# Altium project Elkapod_power_supply.PrjPcb (part 4 of 6)

## Sheet Electronics_power_supply_DC_converter.SchDoc: Electronics power supply
size A3; SheetNumber: 2; SheetTotal: 10
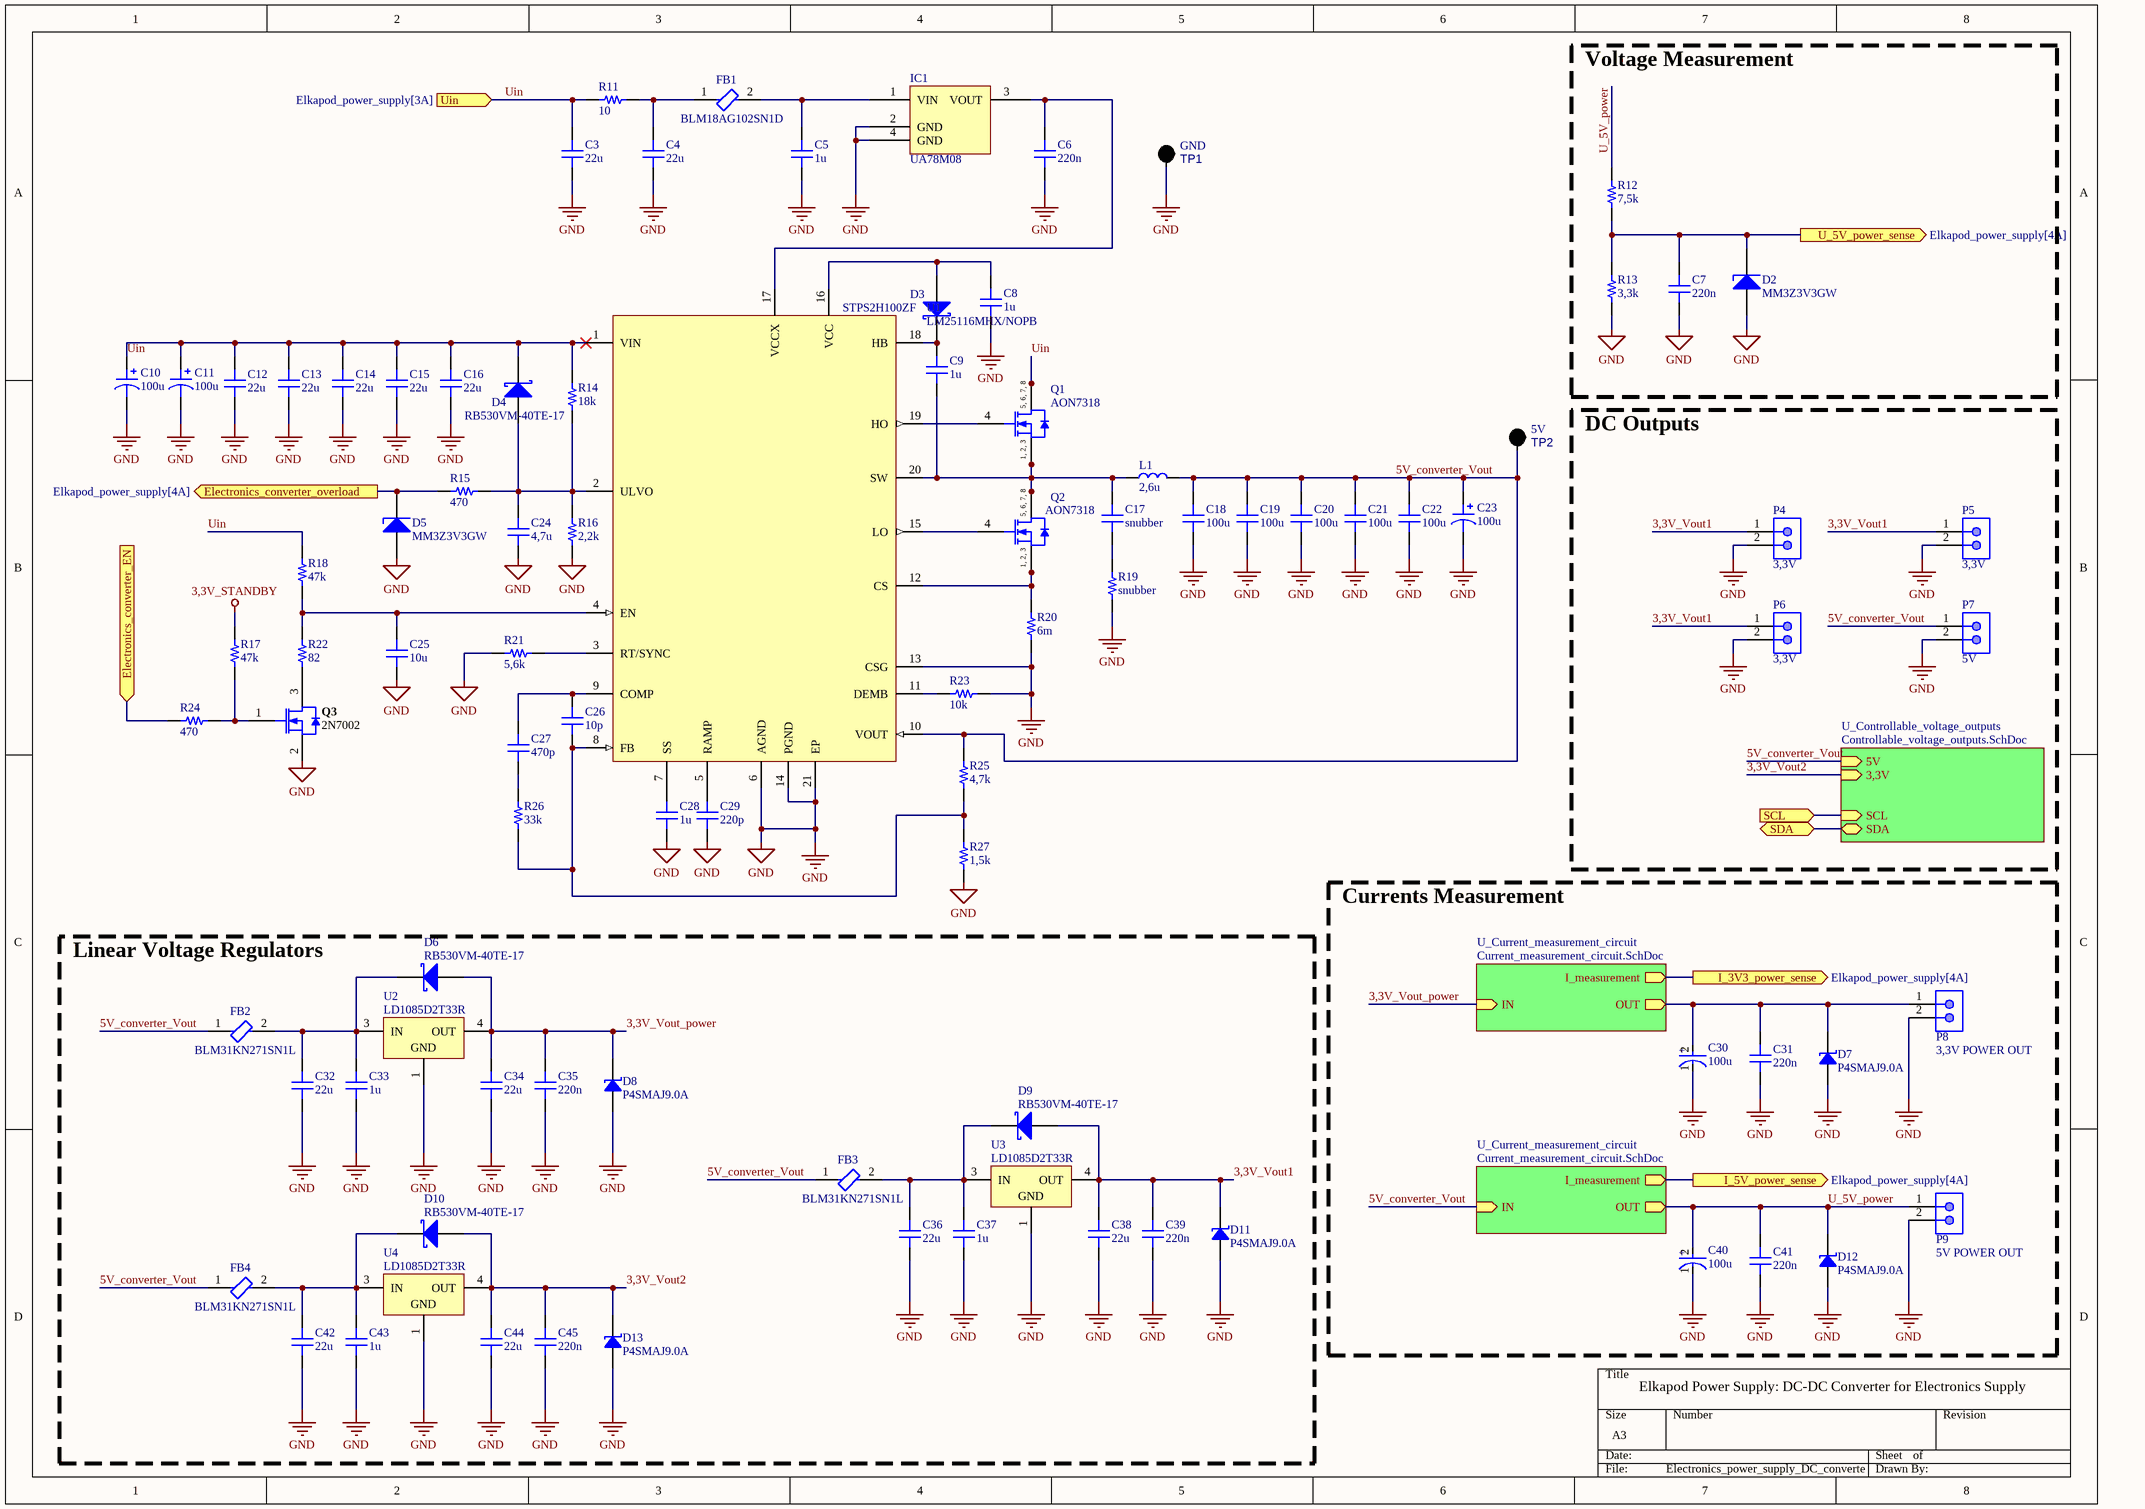
[diagram p7: Electronics_power_supply_DC_converter.SchDoc]

### Parts
C3  22u  [CAP 0805_2012]
C4  22u  [CAP 0805_2012]
C5  1u  [CAP 0603_1608]
C6  220n  [CAP 0603_1608]
C7  220n  [CAP 0603_1608]
C8  1u  [CAP 0603_1608]
C9  1u  [CAP 0603_1608]
C10  100u  [CAP ALSMD 8.3MM H10.5MM]
C11  100u  [CAP ALSMD 8.3MM H10.5MM]
C12  22u  [CAP 0805_2012]
C13  22u  [CAP 0805_2012]
C14  22u  [CAP 0805_2012]
C15  22u  [CAP 0805_2012]
C16  22u  [CAP 0805_2012]
C17  snubber  [CAP 0603_1608]
C18  100u  [CAP 1210_3225 - 1MM]
C19  100u  [CAP 1210_3225 - 1MM]
C20  100u  [CAP 1210_3225 - 1MM]
C21  100u  [CAP 1210_3225 - 1MM]
C22  100u  [CAP 1210_3225 - 1MM]
C23  100u  [CAP ALSMD 8.3MM H10.5MM]
C24  4,7u  [CAP 0603_1608]
C25  10u  [CAP 0603_1608]
C26  10p  [CAP 0603_1608]
C27  470p  [CAP 0603_1608]
C28  1u  [CAP 0603_1608]
C29  220p  [CAP 0603_1608]
C30  100u  [FP-FKE-MFG]
C31  220n  [CAP 0603_1608]
C32  22u  [CAP 0805_2012]
C33  1u  [CAP 0603_1608]
C34  22u  [CAP 0805_2012]
C35  220n  [CAP 0603_1608]
C36  22u  [CAP 0805_2012]
C37  1u  [CAP 0603_1608]
C38  22u  [CAP 0805_2012]
C39  220n  [CAP 0603_1608]
C40  100u  [FP-FKE-MFG]
C41  220n  [CAP 0603_1608]
C42  22u  [CAP 0805_2012]
C43  1u  [CAP 0603_1608]
C44  22u  [CAP 0805_2012]
C45  220n  [CAP 0603_1608]
D2  MM3Z3V3GW  [SOD323]
D3  STPS2H100ZF  [DIOD-SOD-123-2_V]
D4  RB530VM-40TE-17  [SOD-323]
D5  MM3Z3V3GW  [SOD323]
D6  RB530VM-40TE-17  [SOD-323]
D7  P4SMAJ9.0A  [DO214AC SMA]
D8  P4SMAJ9.0A  [DO214AC SMA]
D9  RB530VM-40TE-17  [SOD-323]
D10  RB530VM-40TE-17  [SOD-323]
D11  P4SMAJ9.0A  [DO214AC SMA]
D12  P4SMAJ9.0A  [DO214AC SMA]
D13  P4SMAJ9.0A  [DO214AC SMA]
FB1  BLM18AG102SN1D  [FP-BLM18-0_15-t0_8-MFG]
FB2  BLM31KN271SN1L  [FP-BLM31-0_2-t1_6-d3_3-MFG]
FB3  BLM31KN271SN1L  [FP-BLM31-0_2-t1_6-d3_3-MFG]
FB4  BLM31KN271SN1L  [FP-BLM31-0_2-t1_6-d3_3-MFG]
IC1  UA78M08  [TI SOT-223 DCY]
L1  2,6u  [18,3x18,2_INDUCTOR]
P4  3,3V  [MOLX-22-23-2021_V]
P5  3,3V  [MOLX-22-23-2021_V]
P6  3,3V  [MOLX-22-23-2021_V]
P7  5V  [MOLX-22-23-2021_V]
P8  3,3V POWER OUT  [XT60PW-M]
P9  5V POWER OUT  [XT60PW-M]
Q1  AON7318  [INF-PG-TSDSON-8-1_V]
Q2  AON7318  [INF-PG-TSDSON-8-1_V]
Q3  2N7002  [INF-PG-SOT23_M]
R11  10  [RES 1206_3216]
R12  7,5k  [RES 0603_1608]
R13  3,3k  [RES 0603_1608]
R14  18k  [RES 0603_1608]
R15  470  [RES 0603_1608]
R16  2,2k  [RES 0603_1608]
R17  47k  [RES 0603_1608]
R18  47k  [RES 0603_1608]
R19  snubber  [RES 1206_3216]
R20  6m  [STACKPOLE CSM2512]
R21  5,6k  [RES 0603_1608]
R22  82  [RES 0603_1608]
R23  10k  [RES 0603_1608]
R24  470  [RES 0603_1608]
R25  4,7k  [RES 0603_1608]
R26  33k  [RES 0603_1608]
R27  1,5k  [RES 0603_1608]
TP1  GND  [Keystone_5006_BLACK]
TP2  5V  [Keystone_5006_BLACK]
U1  LM25116MHX/NOPB  [PWP0020A_L]
U2  LD1085D2T33R  [TO-263_M]
U3  LD1085D2T33R  [TO-263_M]
U4  LD1085D2T33R  [TO-263_M]

### Blocks framed on the sheet
Voltage Measurement: C7 D2 R12 R13
DC Outputs: P4-P7
Currents Measurement: C30 C31 C40 C41 D7 D12 P8 P9
Linear Voltage Regulators: C32-C39 C42-C45 D6 D8-D11 D13 FB2-FB4 U2-U4

### Sub-sheets
U_Controllable_voltage_outputs = Controllable_voltage_outputs.SchDoc: 5V (in), 3,3V (in), SCL (in), SDA (bidir)
U_Current_measurement_circuit = Current_measurement_circuit.SchDoc: I_measurement (out), IN (in), OUT (out)  | Rsense_value: 8m
U_Current_measurement_circuit = Current_measurement_circuit.SchDoc: I_measurement (out), IN (in), OUT (out)  | Rsense_value: 8m

### Ports
Electronics_converter_EN (in, see Elkapod_power_supply[3A]), Electronics_converter_overload (out, see Elkapod_power_supply[4A]), I_3V3_power_sense (out, see Elkapod_power_supply[4A]), I_5V_power_sense (out, see Elkapod_power_supply[4A]), SCL (in, see Elkapod_power_supply[3A], Controllable_voltage_outputs[2A], Logic_controller[1D], Servos_controller[1C], Servos_DC_converter[5A]), SDA (bidir, see Elkapod_power_supply[3A], Controllable_voltage_outputs[2B], Logic_controller[1D], Servos_controller[1C], Servos_DC_converter[5A]), U_5V_power_sense (out, see Elkapod_power_supply[4A]), Uin (in, see Elkapod_power_supply[3A])

### Nets
3,3V_STANDBY: R17.1
GND: C3.1 C4.1 C5.1 C6.1 C7.1 C8.2 C10.2 C11.2 C12.1 C13.1 C14.1 C15.1 C16.1 C18.1 C19.1 C20.1 C21.1 C22.1 C23.2 C24.1 C25.1 C28.1 C29.1 C30.1(C) C31.2 C32.1 C33.1 C34.1 C35.1 C36.1 C37.1 C38.1 C39.1 C40.1(C) C41.2 C42.1 C43.1 C44.1 C45.1 D2.1(A) D5.1(A) D7.1 D8.1 D11.1 D12.1 D13.1 IC1.2(GND) IC1.4(GND) P4.2 P5.2 P6.2 P7.2 P8.2(-) P9.2(-) Q3.2(SOURCE) R13.2 R16.1 R19.1 R20.1 R21.2 R23.1 R27.2 TP1.0 U1.6(AGND) U1.13(CSG) U1.14(PGND) U1.21(EP) U2.1(GND) U3.1(GND) U4.1(GND)  [project net AGND]
3,3V_Vout1: C38.2 C39.2 D9.2(A) D11.2 P4.1 P5.1 P6.1 U3.4(OUT)  [project net 3,3V_Vout1_2]
3,3V_Vout2: C44.2 C45.2 D10.2(A) D13.2 U4.4(OUT) ; sheet U_Controllable_voltage_outputs/3,3V
3,3V_Vout_power: C34.2 C35.2 D6.2(A) D8.2 U2.4(OUT) ; sheet U_Current_measurement_circuit/IN
5V_converter_Vout: C18.2 C19.2 C20.2 C21.2 C22.2 C23.1 FB2.1 FB3.1 FB4.1 L1.2 P7.1 R25.1 TP2.0 U1.10(VOUT) ; sheet U_Current_measurement_circuit/IN, sheet U_Controllable_voltage_outputs/5V
CONV5_OC: D5.2(K) R15.2 ; port Electronics_converter_overload
ELE_CONV_EN: R24.1 ; port Electronics_converter_EN
I_3V3_POW_SENSE: port I_3V3_power_sense, sheet U_Current_measurement_circuit/I_measurement
I_5V_POW_SENSE: port I_5V_power_sense, sheet U_Current_measurement_circuit/I_measurement
SCL: port SCL, sheet U_Controllable_voltage_outputs/SCL
SDA: port SDA, sheet U_Controllable_voltage_outputs/SDA
U_5V_POW_SENSE: C7.2 D2.2(K) R12.2 R13.1 ; port U_5V_power_sense
U_5V_power: C40.2(A) C41.1 D12.2 P9.1(+) R12.1 ; sheet U_Current_measurement_circuit/OUT
Uin: C3.2 C10.1 C11.1 C12.2 C13.2 C14.2 C15.2 C16.2 D4.1(K) Q1.5(DRAIN) Q1.6(DRAIN) Q1.7(DRAIN) Q1.8(DRAIN) R11.1 R14.1 R18.1 U1.1(VIN) ; port Uin
NetC4_2: C4.2 FB1.1 R11.2
NetC5_2: C5.2 FB1.2 IC1.1(VIN)
NetC6_2: C6.2 IC1.3(VOUT) U1.17(VCCX)
NetC8_1: C8.1 D3.1(A) U1.16(VCC)
NetC9_1: C9.1 C17.2 L1.1 Q1.1(SOURCE) Q1.2(SOURCE) Q1.3(SOURCE) Q2.5(DRAIN) Q2.6(DRAIN) Q2.7(DRAIN) Q2.8(DRAIN) U1.20(SW)
NetC9_2: C9.2 D3.2(K) U1.18(HB)
NetC17_1: C17.1 R19.2
NetC24_2: C24.2 D4.2(A) R14.2 R15.1 R16.2 U1.2(ULVO)
NetC25_2: C25.2 R18.2 R22.1 U1.4(EN)
NetC26_1: C26.1 C27.1 U1.9(COMP)
NetC26_2: C26.2 R25.2 R26.2 R27.1 U1.8(FB)
NetC27_2: C27.2 R26.1
NetC28_2: C28.2 U1.7(SS)
NetC29_2: C29.2 U1.5(RAMP)
NetC30_2: C30.2(A) C31.1 D7.2 P8.1(+) ; sheet U_Current_measurement_circuit/OUT
NetC32_2: C32.2 C33.2 D6.1(K) FB2.2 U2.3(IN)
NetC36_2: C36.2 C37.2 D9.1(K) FB3.2 U3.3(IN)
NetC42_2: C42.2 C43.2 D10.1(K) FB4.2 U4.3(IN)
NetQ1_4: Q1.4(GATE) U1.19(HO)
NetQ2_1: Q2.1(SOURCE) Q2.2(SOURCE) Q2.3(SOURCE) R20.2 U1.12(CS)
NetQ2_4: Q2.4(GATE) U1.15(LO)
NetQ3_1: Q3.1(GATE) R17.2 R24.2
NetQ3_3: Q3.3(DRAIN) R22.2
NetR21_1: R21.1 U1.3(RT/SYNC)
NetR23_2: R23.2 U1.11(DEMB)

### Notes on the sheet
- Elkapod Power Supply: DC-DC Converter for Electronics Supply
- (in symbol BSZ050N03MS G) 5, 6, 7, 8; 1, 2, 3
- (in symbol CMP-2000-06205-2) +
- (in symbol AON7318) 5, 6, 7, 8; 1, 2, 3

### Library data of the parts
C3 C4 C12-C16 C32 C34 C36 C38 C42 C44 = VJ0805Y684KXQTW1BC: CAP CER 22UF 25V X7R 0805; manufacturer: Vishay Vitramon; Tolerance: ±10%; Voltage - Rated: 10V; Part Number: VJ0805Y684KXQTW1BC; Value: 22u; Applications: General Purpose; Capacitance: 22u; componentlink1description: Datasheet; componentlink1url: https://www.vishay.com/docs/28548/vjw1bcbascomseries.pdf; componentlink2description: DigiKey Link; componentlink2url: https://www.digikey.com/en/products/detail/vishay-vitramon/VJ0805Y684KXQTW1BC/8313569; Device Package: 0805 (2012 Metric); lastupdated: 09.02.2024 20:13:13; Lifecycle Status: Active; Minimum Order: 1; Mounting Type: Surface Mount, MLCC; Operating Temperature: -55°C ~ 125°C; Package / Case: 0805 (2012 Metric); packaging: TapeAndReel; partid: 57262; price: 0.05; series: VJ W1BC; Size / Dimension: 0.079" L x 0.049" W (2.00mm x 1.25mm); Temperature Coefficient: X7R; Thickness (Max): 0.053" (1.35mm)
C5 C8 C9 = C0603C272F3GAC7867: CAP CER 1uF 25V X5R 0603; manufacturer: KEMET; Temperature Coefficient: C0G, NP0; Tolerance: ±1%; Part Number: C0603C272F3GAC7867; Value: 1u; Applications: General Purpose; Capacitance: 1u; componentlink1description: Datasheet; componentlink1url: https://api.kemet.com/component-edge/download/datasheet/C0603C272F3GACTU.pdf; componentlink2description: DigiKey Link; componentlink2url: https://www.digikey.com/en/products/detail/kemet/C0603C272F3GAC7867/2200413; Device Package: 0603 (1608 Metric); Features: Low ESL; lastupdated: 09.02.2024 20:10:30; Lifecycle Status: Active; Minimum Order: 1; Mounting Type: Surface Mount, MLCC; Operating Temperature: -55°C ~ 125°C; Package / Case: 0603 (1608 Metric); packaging: TapeAndReel; partid: 2138; Part Status: Active; price: 0.40; series: SMD Comm C0G; Size / Dimension: 0.063" L x 0.031" W (1.60mm x 0.80mm); Thickness (Max): 0.034" (0.87mm); Voltage - Rated: 25V
C6 C7 C31 C35 C39 C41 C45 = C0603C272F3GAC7867: CAP CER 220nF 25V X5R 0603; manufacturer: KEMET; Temperature Coefficient: C0G, NP0; Tolerance: ±1%; Part Number: C0603C272F3GAC7867; Value: 220n; Applications: General Purpose; Capacitance: 220n; componentlink1description: Datasheet; componentlink1url: https://api.kemet.com/component-edge/download/datasheet/C0603C272F3GACTU.pdf; componentlink2description: DigiKey Link; componentlink2url: https://www.digikey.com/en/products/detail/kemet/C0603C272F3GAC7867/2200413; Device Package: 0603 (1608 Metric); Features: Low ESL; lastupdated: 09.02.2024 20:10:30; Lifecycle Status: Active; Minimum Order: 1; Mounting Type: Surface Mount, MLCC; Operating Temperature: -55°C ~ 125°C; Package / Case: 0603 (1608 Metric); packaging: TapeAndReel; partid: 2138; Part Status: Active; price: 0.40; series: SMD Comm C0G; Size / Dimension: 0.063" L x 0.031" W (1.60mm x 0.80mm); Thickness (Max): 0.034" (0.87mm); Voltage - Rated: 25V
C10 C11 C23 = EEE-TC1C101P: UCD1V101MNL1GS; CAP ALUM 100UF 20% 16V SMD; value: 100u
C17 = C0603C272F3GAC7867: CAP CER 50V X5R 0603; manufacturer: KEMET; Temperature Coefficient: C0G, NP0; Tolerance: ±1%; Voltage - Rated: 25V; Part Number: C0603C272F3GAC7867; Value: snubber; Applications: General Purpose; Capacitance: snubber; componentlink1description: Datasheet; componentlink1url: https://api.kemet.com/component-edge/download/datasheet/C0603C272F3GACTU.pdf; componentlink2description: DigiKey Link; componentlink2url: https://www.digikey.com/en/products/detail/kemet/C0603C272F3GAC7867/2200413; Device Package: 0603 (1608 Metric); Features: Low ESL; lastupdated: 09.02.2024 20:10:30; Lifecycle Status: Active; Minimum Order: 1; Mounting Type: Surface Mount, MLCC; Operating Temperature: -55°C ~ 125°C; Package / Case: 0603 (1608 Metric); packaging: TapeAndReel; partid: 2138; Part Status: Active; price: 0.40; series: SMD Comm C0G; Size / Dimension: 0.063" L x 0.031" W (1.60mm x 0.80mm); Thickness (Max): 0.034" (0.87mm)
C18-C22 = CAN13X104KARAC7800: as C60-C64 on sheet Servos_DC_converter; Part Number: CAN13X104KARAC7800; Value: 100u; Applications: Boardflex Sensitive; Capacitance: 100u; componentlink1description: Datasheet; componentlink1url: //media.digikey.com/pdf/Data%20Sheets/Kemet%20PDFs/CAN13X104KARACTU_Spec.pdf; componentlink2description: DigiKey Link; componentlink2url: https://www.digikey.com/en/products/detail/kemet/CAN13X104KARAC7800/9962480; Device Package: 1210 (3225 Metric); Features: Low ESL, Soft Termination; lastupdated: 04.06.2024 19:21:07; Lifecycle Status: Active; Minimum Order: 1; Mounting Type: Surface Mount, MLCC; Operating Temperature: -55°C ~ 125°C; Package / Case: 1210 (3225 Metric); packaging: TapeAndReel; partid: 23615; Part Status: Active; price: 0.39; series: CAN SMD Indust X7R; Size / Dimension: 0.130" L x 0.102" W (3.30mm x 2.60mm); Temperature Coefficient: X7R; Thickness (Max): 0.110" (2.80mm)
C24 = C0603C272F3GAC7867: CAP CER 4,7uF 25V X5R 0603; manufacturer: KEMET; Temperature Coefficient: C0G, NP0; Tolerance: ±1%; Part Number: C0603C272F3GAC7867; Value: 4,7u; Applications: General Purpose; Capacitance: 4,7u; componentlink1description: Datasheet; componentlink1url: https://api.kemet.com/component-edge/download/datasheet/C0603C272F3GACTU.pdf; componentlink2description: DigiKey Link; componentlink2url: https://www.digikey.com/en/products/detail/kemet/C0603C272F3GAC7867/2200413; Device Package: 0603 (1608 Metric); Features: Low ESL; lastupdated: 09.02.2024 20:10:30; Lifecycle Status: Active; Minimum Order: 1; Mounting Type: Surface Mount, MLCC; Operating Temperature: -55°C ~ 125°C; Package / Case: 0603 (1608 Metric); packaging: TapeAndReel; partid: 2138; Part Status: Active; price: 0.40; series: SMD Comm C0G; Size / Dimension: 0.063" L x 0.031" W (1.60mm x 0.80mm); Thickness (Max): 0.034" (0.87mm); Voltage - Rated: 25V
C25 = C0603C272F3GAC7867: CAP CER 10uF 35V X5R 0603; manufacturer: KEMET; Temperature Coefficient: C0G, NP0; Tolerance: ±1%; Voltage - Rated: 25V; Part Number: C0603C272F3GAC7867; Value: 10u; Applications: General Purpose; Capacitance: 10u; componentlink1description: Datasheet; componentlink1url: https://api.kemet.com/component-edge/download/datasheet/C0603C272F3GACTU.pdf; componentlink2description: DigiKey Link; componentlink2url: https://www.digikey.com/en/products/detail/kemet/C0603C272F3GAC7867/2200413; Device Package: 0603 (1608 Metric); Features: Low ESL; lastupdated: 09.02.2024 20:10:30; Lifecycle Status: Active; Minimum Order: 1; Mounting Type: Surface Mount, MLCC; Operating Temperature: -55°C ~ 125°C; Package / Case: 0603 (1608 Metric); packaging: TapeAndReel; partid: 2138; Part Status: Active; price: 0.40; series: SMD Comm C0G; Size / Dimension: 0.063" L x 0.031" W (1.60mm x 0.80mm); Thickness (Max): 0.034" (0.87mm)
C26 = C0603C272F3GAC7867: CAP CER 10pF 50V G0C 0603; manufacturer: KEMET; Temperature Coefficient: C0G, NP0; Tolerance: ±1%; Voltage - Rated: 25V; Part Number: C0603C272F3GAC7867; Value: 10p; Applications: General Purpose; Capacitance: 10p; componentlink1description: Datasheet; componentlink1url: https://api.kemet.com/component-edge/download/datasheet/C0603C272F3GACTU.pdf; componentlink2description: DigiKey Link; componentlink2url: https://www.digikey.com/en/products/detail/kemet/C0603C272F3GAC7867/2200413; Device Package: 0603 (1608 Metric); Features: Low ESL; lastupdated: 09.02.2024 20:10:30; Lifecycle Status: Active; Minimum Order: 1; Mounting Type: Surface Mount, MLCC; Operating Temperature: -55°C ~ 125°C; Package / Case: 0603 (1608 Metric); packaging: TapeAndReel; partid: 2138; Part Status: Active; price: 0.40; series: SMD Comm C0G; Size / Dimension: 0.063" L x 0.031" W (1.60mm x 0.80mm); Thickness (Max): 0.034" (0.87mm)
C27 = C0603C272F3GAC7867: CAP CER 470pF 50V G0C 0603; manufacturer: KEMET; Temperature Coefficient: C0G, NP0; Tolerance: ±1%; Voltage - Rated: 25V; Part Number: C0603C272F3GAC7867; Value: 470p; Applications: General Purpose; Capacitance: 470p; componentlink1description: Datasheet; componentlink1url: https://api.kemet.com/component-edge/download/datasheet/C0603C272F3GACTU.pdf; componentlink2description: DigiKey Link; componentlink2url: https://www.digikey.com/en/products/detail/kemet/C0603C272F3GAC7867/2200413; Device Package: 0603 (1608 Metric); Features: Low ESL; lastupdated: 09.02.2024 20:10:30; Lifecycle Status: Active; Minimum Order: 1; Mounting Type: Surface Mount, MLCC; Operating Temperature: -55°C ~ 125°C; Package / Case: 0603 (1608 Metric); packaging: TapeAndReel; partid: 2138; Part Status: Active; price: 0.40; series: SMD Comm C0G; Size / Dimension: 0.063" L x 0.031" W (1.60mm x 0.80mm); Thickness (Max): 0.034" (0.87mm)
C28 C33 C37 C43 = C0603C272F3GAC7867: CAP CER 1uF 16V X5R 0603; manufacturer: KEMET; Temperature Coefficient: C0G, NP0; Tolerance: ±1%; Voltage - Rated: 25V; Part Number: C0603C272F3GAC7867; Value: 1u; Applications: General Purpose; Capacitance: 1u; componentlink1description: Datasheet; componentlink1url: https://api.kemet.com/component-edge/download/datasheet/C0603C272F3GACTU.pdf; componentlink2description: DigiKey Link; componentlink2url: https://www.digikey.com/en/products/detail/kemet/C0603C272F3GAC7867/2200413; Device Package: 0603 (1608 Metric); Features: Low ESL; lastupdated: 09.02.2024 20:10:30; Lifecycle Status: Active; Minimum Order: 1; Mounting Type: Surface Mount, MLCC; Operating Temperature: -55°C ~ 125°C; Package / Case: 0603 (1608 Metric); packaging: TapeAndReel; partid: 2138; Part Status: Active; price: 0.40; series: SMD Comm C0G; Size / Dimension: 0.063" L x 0.031" W (1.60mm x 0.80mm); Thickness (Max): 0.034" (0.87mm)
C29 = C0603C272F3GAC7867: CAP CER 220pF 50V G0C 0603; manufacturer: KEMET; Temperature Coefficient: C0G, NP0; Tolerance: ±1%; Voltage - Rated: 25V; Part Number: C0603C272F3GAC7867; Value: 220p; Applications: General Purpose; Capacitance: 220p; componentlink1description: Datasheet; componentlink1url: https://api.kemet.com/component-edge/download/datasheet/C0603C272F3GACTU.pdf; componentlink2description: DigiKey Link; componentlink2url: https://www.digikey.com/en/products/detail/kemet/C0603C272F3GAC7867/2200413; Device Package: 0603 (1608 Metric); Features: Low ESL; lastupdated: 09.02.2024 20:10:30; Lifecycle Status: Active; Minimum Order: 1; Mounting Type: Surface Mount, MLCC; Operating Temperature: -55°C ~ 125°C; Package / Case: 0603 (1608 Metric); packaging: TapeAndReel; partid: 2138; Part Status: Active; price: 0.40; series: SMD Comm C0G; Size / Dimension: 0.063" L x 0.031" W (1.60mm x 0.80mm); Thickness (Max): 0.034" (0.87mm)
C30 C40 = CMP-2000-06205-2: CAP ALUM 100UF 20% 25V SMD; Ripple Current (AC): 300mA; Leakage Current: 3uA; Dielectric Material: Aluminium; Impedance: 260mR; Life (Hours): 2000Hour; Max Operating Temperature: 105°C; Voltage Rating (DC): 25V; Packaging: Tape and Reel; Min Operating Temperature: -55°C; Capacitance: 100uF; Ripple Current: 300mA; Mount: Surface Mount; Lead Free: Lead Free; Construction: Cylindrical; Voltage Rating: 25V; RoHS Compliant: Yes; Case/Package: Radial; Height: 6.2mm; Tolerance: 20%; Diameter: 8mm; Termination: SMD/SMT; Package Quantity: 1; Width: 8.3mm; REACH SVHC: No SVHC; Series: FK; Number of Pins: 2; Voltage: 25V; Radiation Hardening: No; Height - Seated (Max): 0.244inch; Length: 6.2mm; ESR (Equivalent Series Resistance): 260mR
D2 D5 = Zener_Diode_SOD323: 3,3V, 0,3W Zener diode; SOD323
D3 = CMP-0303-00004-1: Schottky diode; 2A; 100V
D4 D6 D9 D10 = BAS140W: Schottky diode; 0,1A; 40V; Published: 21-Mar-2003; LatestRevisionDate: 19-Mar-2004; LatestRevisionNote: Silkscreen size reduced.; DatasheetDocument: Oct-1999; PackageDocument: Sep-2000; PackageReference: SOD-323; Publisher: Altium Limited; ComponentLink1Description: Manufacturer Link; ComponentLink1URL: http://www.infineon.com/; ComponentLink2Description: Datasheet; ComponentLink2URL: http://www.infineon.com/upload/Document/cmc_upload/documents/009/386/bas70_bas170series_1.pdf
D7 D8 D11-D13 = SMA6J18A-TP: TVS DIODE 9VDC DO214AC; Part Number: P4SMAJ9.0A
FB1 = CMP-0686-00457-3: Chip Ferrite Bead, 0603, 1000Ω @ 100MHz, 0.5Ω, 25%, 450mA; Number of Circuits: 1; Max DC Current: 400mA; Shielding: Unshielded; DC Resistance (DCR): 500mR; Material: Steel; DC Resistance-Max: 700mR; Impedance: 1kR; Case Code (Imperial): 0603; Max Current Rating: 400mA; Frequency: 100MHz; Min Operating Temperature: -55°C; Case/Package: 0603; Depth: 0.8mm; Lead Free: Lead Free; Core Material: Ferrite; Current Rating: 400mA; Resistance: 500mR; Case Code (Metric): 1608; DC Current: 400mA; Package Quantity: 1; Packaging: Tape and Reel; Width: 0.8mm; Military Standard: Not; Height: 0.8mm; Series: BLM18A; Max Operating Temperature: 125°C; Tolerance: 25%; Termination: SMD/SMT; Test Frequency: 100MHz; Number of Lines: 1; Number of Pins: 2; REACH SVHC: No SVHC; Length: 1.6mm; Radiation Hardening: No
FB2-FB4 = CMP-06046-002074-1: Chip Ferrite Bead, 1206, 270Ω @ 100MHz, 0.016Ω, 25%, 4.5A; DC Resistance (DCR): 16mR; Number of Lines: 1; Mount: Surface Mount; Case Code (Imperial): 1206; Case/Package: 1206; Packaging: Cut Tape; Min Operating Temperature: -55°C; Max Current Rating: 4.5A; Case Code (Metric): 3216; Max Operating Temperature: 125°C
IC1 = LM340MP-5.0/NOPB: IC REG LINEAR 8V 0,5A SOT223; Manufacturer: Texas Instruments; Current - Output: 1.5A; Number of Regulators: 1; Output Configuration: Positive; Output Type: Fixed; Part Number: UA78M08; ComponentLink1Description: Datasheet; ComponentLink1URL: http://www.ti.com/general/docs/suppproductinfo.tsp?distId=10&gotoUrl=http%3A%2F%2Fwww.ti.com%2Flit%2Fgpn%2Flm340; ComponentLink2Description: DigiKey Link; ComponentLink2URL: //digikey.com/product-detail/en/texas-instruments/LM340MP-5.0-NOPB/LM340MP-5.0-NOPBTR-ND/270717; Lifecycle Status: 0; Operating Temperature: 0°C ~ 125°C; Package / Case: TO-261-4, TO-261AA; Packaging: TapeAndReel; Voltage - Output (Min/Fixed): 8V
L1 = 18,3x18,2_INDUCTOR: Power inductor, 2,6uH, Imax = 25,5A, Isat = 50A
P4-P7 = CMP-1704-00001-3: Male Header, Pitch 2.54 mm, 1 x 2 Position, Height 10.67 mm, Tail Length 3.56 mm, 0 to 75 degC, RoHS, Bulk; Package Quantity: 3000; Height: 10.67 mm; RoHSCompliant: True; ComponentLink2URL: https://datasheet.ciiva.com/19454/232266-19454304.pdf; PartNumber: 22-23-2021; Packaging: Bulk; ComponentLink2Description: Datasheet; Min Operating Temperature: 0 degC; ComponentLink1Description: Manufacturer URL; Length: 5.08 mm; Mounting Technology: Through Hole; Max Operating Temperature: 75 degC; REACH SVHC: Unknown; PackageDescription: Male Header, Pitch 2.54 mm, 1 x 2 Position, Height 10.67 mm, Tail Length 3.56 mm; ComponentLink1URL: http://www.molex.com/; Mount: Through Hole; Radiation Hardening: No; Width: 6.35 mm; Pins: 2
P8 P9 = XT60PW-M: XT60PW-M; 30A/500V angled female DC PCB socket (pin1 -> +, pin2 -> -)
Q1 Q2 = BSZ050N03MS G: N-Channel Power-MOSFET, 30 V VDS, 50 A ID, PG-TSDSON-8-1; Manufacturer: Infineon; ID (max): 50 A; IDpuls (max): 190 A; Polarity: N; PackageReference: PG-TSDSON-8-1; PackageDescription: 8-Pin Plastic (Green) Thin Dual Small Outline Non-Leaded Package, 3.3 x 3.3 mm Body, 0.65 mm Pitch; Mounting Technology: Surface Mount
Q3 = CMP-1149-00026-1: N-Channel OptiMOS Small-Signal-Transistor, 60 V VDS, 0.3 A ID, -55 to 150 degC, PG-SOT23, Reel, Green; Manufacturer: Infineon; RDS (on) (max) (@4.5V): 4,000 mOhm; VDS (max): 60 V; IDpuls (max): 1.2Â A; QG: 0.4Â nC; RDS (on) (max): 3,000 mOhm; RthJA (max): 250 K/W; ID (max): 0.3Â A; VGS(th) (max): 2.5Â V; VGS(th) (min): 1.5Â V; Green: TRUE; Ptot (max): 0.5Â W; PackageDescription: 3-Pin Small Outline Transistor Package, 2.9 x 1.3 mm Body, 0.95 mm Pitch; Halogen-free: TRUE; ComponentLink2Description: Datasheet; ComponentLink1URL: http://www.infineon.com/; Packing: Reel; DatasheetVersion: Rev. 2.4; PartNumber: 2N7002; PackageReference: PG-SOT23; PackageVersion: Apr-08; ComponentLink3URL: http://www.infineon.com/dgdl/SOT23-Package_Overview.pdf?folderId=db3a30431936bc4b0119532290053c66&fileId=db3a30431936bc4b0119533468123c85; ComponentLink1Description: Manufacturer URL; Mounting Technology: Surface Mount; ComponentLink3Description: Package Specification; ComponentLink2URL: http://www.infineon.com/dgdl/2N7002_Rev2.4.pdf?folderId=db3a3043156fd573011622e10b5c1f67&fileId=db3a304319bc939a0119c2a9461e79e6
R11 = KRL1632E-M-R120-F-T5: RES 10 OHM 1% 3/4W 1206; Manufacturer: Susumu; Power (Watts): 0.75W, 3/4W; Temperature Coefficient: ±50ppm/°C; Part Number: KRL1632E-M-R120-F-T5; ComponentLink1Description: Datasheet; ComponentLink1URL: http://www.susumu.co.jp/common/pdf/n_catalog_partition09_en.pdf; ComponentLink2Description: DigiKey Link; ComponentLink2URL: https://www.digikey.com/en/products/detail/susumu/KRL1632E-M-R120-F-T5/3738009; Composition: Metal Foil; Device Package: 1206 (3216 Metric); Features: Automotive AEC-Q200, Current Sense; Height - Seated (Max): 0.028" (0.70mm); LastUpdated: 09.02.2024 20:54:46; Lifecycle Status: Active; Minimum Order: 1; Number of Terminations: 2; Operating Temperature: -55°C ~ 155°C; Package / Case: 1206 (3216 Metric); Packaging: TapeAndReel; PartId: 26840; Part Status: Active; Price: 0.09; Ratings: AEC-Q200; Resistance: 10; Series: KRL; Size / Dimension: 0.126" L x 0.063" W (3.20mm x 1.60mm); Supplier Device Package: 1206; Tolerance: ±1%; Value: 10
R12 = RNCS0603BKE10K0: RES 7,5K OHM 1% 0,1W 0603; Manufacturer: Stackpole Electronics Inc; Power (Watts): 0.063W, 1/16W; Temperature Coefficient: ±25ppm/°C; Tolerance: ±0.1%; Part Number: RNCS0603BKE10K0; Value: 7,5k; Composition: Thin Film; Device Package: 0603 (1608 Metric); Features: Anti-Corrosive, Automotive AEC-Q200, Moisture Resistant; Height - Seated (Max): 0.022" (0.55mm); LastUpdated: 09.02.2024 20:43:37; Lifecycle Status: Active; Minimum Order: 1; Number of Terminations: 2; Operating Temperature: -55°C ~ 155°C; Package / Case: 0603 (1608 Metric); Packaging: TapeAndReel; PartId: 4838; Part Status: Active; Price: 0.06; Ratings: AEC-Q200; Resistance: 7,5k; Series: RNCS; Size / Dimension: 0.061" L x 0.031" W (1.55mm x 0.80mm); Supplier Device Package: 0603
R13 = RNCS0603BKE10K0: RES 3,3K OHM 1% 0,1W 0603; Manufacturer: Stackpole Electronics Inc; Power (Watts): 0.063W, 1/16W; Temperature Coefficient: ±25ppm/°C; Tolerance: ±0.1%; Part Number: RNCS0603BKE10K0; Value: 3,3k; Composition: Thin Film; Device Package: 0603 (1608 Metric); Features: Anti-Corrosive, Automotive AEC-Q200, Moisture Resistant; Height - Seated (Max): 0.022" (0.55mm); LastUpdated: 09.02.2024 20:43:37; Lifecycle Status: Active; Minimum Order: 1; Number of Terminations: 2; Operating Temperature: -55°C ~ 155°C; Package / Case: 0603 (1608 Metric); Packaging: TapeAndReel; PartId: 4838; Part Status: Active; Price: 0.06; Ratings: AEC-Q200; Resistance: 3,3k; Series: RNCS; Size / Dimension: 0.061" L x 0.031" W (1.55mm x 0.80mm); Supplier Device Package: 0603
R14 = RNCS0603BKE10K0: RES 18K OHM 1% 0,1W 0603; Manufacturer: Stackpole Electronics Inc; Power (Watts): 0.063W, 1/16W; Temperature Coefficient: ±25ppm/°C; Tolerance: ±0.1%; Part Number: RNCS0603BKE10K0; Value: 18k; Composition: Thin Film; Device Package: 0603 (1608 Metric); Features: Anti-Corrosive, Automotive AEC-Q200, Moisture Resistant; Height - Seated (Max): 0.022" (0.55mm); LastUpdated: 09.02.2024 20:43:37; Lifecycle Status: Active; Minimum Order: 1; Number of Terminations: 2; Operating Temperature: -55°C ~ 155°C; Package / Case: 0603 (1608 Metric); Packaging: TapeAndReel; PartId: 4838; Part Status: Active; Price: 0.06; Ratings: AEC-Q200; Resistance: 18k; Series: RNCS; Size / Dimension: 0.061" L x 0.031" W (1.55mm x 0.80mm); Supplier Device Package: 0603
R15 R24 = RNCS0603BKE10K0: RES 470 OHM 1% 0,1W 0603; Manufacturer: Stackpole Electronics Inc; Power (Watts): 0.063W, 1/16W; Temperature Coefficient: ±25ppm/°C; Tolerance: ±0.1%; Part Number: RNCS0603BKE10K0; Value: 470; Composition: Thin Film; Device Package: 0603 (1608 Metric); Features: Anti-Corrosive, Automotive AEC-Q200, Moisture Resistant; Height - Seated (Max): 0.022" (0.55mm); LastUpdated: 09.02.2024 20:43:37; Lifecycle Status: Active; Minimum Order: 1; Number of Terminations: 2; Operating Temperature: -55°C ~ 155°C; Package / Case: 0603 (1608 Metric); Packaging: TapeAndReel; PartId: 4838; Part Status: Active; Price: 0.06; Ratings: AEC-Q200; Resistance: 470; Series: RNCS; Size / Dimension: 0.061" L x 0.031" W (1.55mm x 0.80mm); Supplier Device Package: 0603
R16 = RNCS0603BKE10K0: RES 2,2K OHM 1% 0,1W 0603; Manufacturer: Stackpole Electronics Inc; Power (Watts): 0.063W, 1/16W; Temperature Coefficient: ±25ppm/°C; Tolerance: ±0.1%; Part Number: RNCS0603BKE10K0; Value: 2,2k; Composition: Thin Film; Device Package: 0603 (1608 Metric); Features: Anti-Corrosive, Automotive AEC-Q200, Moisture Resistant; Height - Seated (Max): 0.022" (0.55mm); LastUpdated: 09.02.2024 20:43:37; Lifecycle Status: Active; Minimum Order: 1; Number of Terminations: 2; Operating Temperature: -55°C ~ 155°C; Package / Case: 0603 (1608 Metric); Packaging: TapeAndReel; PartId: 4838; Part Status: Active; Price: 0.06; Ratings: AEC-Q200; Resistance: 2,2k; Series: RNCS; Size / Dimension: 0.061" L x 0.031" W (1.55mm x 0.80mm); Supplier Device Package: 0603
R17 R18 = RNCS0603BKE10K0: RES 47K OHM 1% 0,1W 0603; Manufacturer: Stackpole Electronics Inc; Power (Watts): 0.063W, 1/16W; Temperature Coefficient: ±25ppm/°C; Tolerance: ±0.1%; Part Number: RNCS0603BKE10K0; Value: 47k; Composition: Thin Film; Device Package: 0603 (1608 Metric); Features: Anti-Corrosive, Automotive AEC-Q200, Moisture Resistant; Height - Seated (Max): 0.022" (0.55mm); LastUpdated: 09.02.2024 20:43:37; Lifecycle Status: Active; Minimum Order: 1; Number of Terminations: 2; Operating Temperature: -55°C ~ 155°C; Package / Case: 0603 (1608 Metric); Packaging: TapeAndReel; PartId: 4838; Part Status: Active; Price: 0.06; Ratings: AEC-Q200; Resistance: 47k; Series: RNCS; Size / Dimension: 0.061" L x 0.031" W (1.55mm x 0.80mm); Supplier Device Package: 0603
R19 = RT1206BRD0775KL: Manufacturer: Yageo; Power (Watts): 0.25W, 1/4W; Temperature Coefficient: ±25ppm/°C; Tolerance: ±0.1%; Part Number: RT1206BRD0775KL; Composition: Thin Film; Device Package: 1206 (3216 Metric); Height - Seated (Max): 0.026" (0.65mm); LastUpdated: 09.02.2024 20:54:46; Lifecycle Status: Active; Minimum Order: 1; Number of Terminations: 2; Operating Temperature: -55°C ~ 155°C; Package / Case: 1206 (3216 Metric); Packaging: TapeAndReel; PartId: 26866; Part Status: Active; Price: 0.09; Series: RT; Size / Dimension: 0.122" L x 0.063" W (3.10mm x 1.60mm); Supplier Device Package: 1206
R20 = CSM2512FT20L0: RES 0,006 OHM 1% 3W 2512; manufacturer: Stackpole Electronics Inc; Temperature Coefficient: ±50ppm/°C; value: 20 mOhms; Part Number: CSM2512FT20L0; componentlink1description: Datasheet; componentlink1url: https://www.seielect.com/Catalog/SEI-CSM.PDF; componentlink2description: DigiKey Link; componentlink2url: https://www.digikey.com/en/products/detail/stackpole-electronics-inc/CSM2512FT20L0/6270239; Composition: Metal Element; Device Package: 2512 (6332 Metric); Features: Current Sense; Height - Seated (Max): 0.035" (0.90mm); lastupdated: 03.06.2024 20:27:03; Lifecycle Status: Active; Minimum Order: 4000; Number of Terminations: 2; Operating Temperature: -55°C ~ 170°C; Package / Case: 2512 (6332 Metric); packaging: TapeAndReel; Part Status: Active; Power (Watts): 3W; price: 0.19; Resistance: 6m; series: CSM; Size / Dimension: 0.252" L x 0.126" W (6.40mm x 3.20mm); Supplier Device Package: 2512; Tolerance: ±1%
R21 = RNCS0603BKE10K0: RES 5,6K OHM 1% 0,1W 0603; Manufacturer: Stackpole Electronics Inc; Power (Watts): 0.063W, 1/16W; Temperature Coefficient: ±25ppm/°C; Tolerance: ±0.1%; Part Number: RNCS0603BKE10K0; Value: 5,6k; Composition: Thin Film; Device Package: 0603 (1608 Metric); Features: Anti-Corrosive, Automotive AEC-Q200, Moisture Resistant; Height - Seated (Max): 0.022" (0.55mm); LastUpdated: 09.02.2024 20:43:37; Lifecycle Status: Active; Minimum Order: 1; Number of Terminations: 2; Operating Temperature: -55°C ~ 155°C; Package / Case: 0603 (1608 Metric); Packaging: TapeAndReel; PartId: 4838; Part Status: Active; Price: 0.06; Ratings: AEC-Q200; Resistance: 5,6k; Series: RNCS; Size / Dimension: 0.061" L x 0.031" W (1.55mm x 0.80mm); Supplier Device Package: 0603
R22 = RNCS0603BKE10K0: RES 82 OHM 1% 0,1W 0603; Manufacturer: Stackpole Electronics Inc; Power (Watts): 0.063W, 1/16W; Temperature Coefficient: ±25ppm/°C; Tolerance: ±0.1%; Part Number: RNCS0603BKE10K0; Value: 82; Composition: Thin Film; Device Package: 0603 (1608 Metric); Features: Anti-Corrosive, Automotive AEC-Q200, Moisture Resistant; Height - Seated (Max): 0.022" (0.55mm); LastUpdated: 09.02.2024 20:43:37; Lifecycle Status: Active; Minimum Order: 1; Number of Terminations: 2; Operating Temperature: -55°C ~ 155°C; Package / Case: 0603 (1608 Metric); Packaging: TapeAndReel; PartId: 4838; Part Status: Active; Price: 0.06; Ratings: AEC-Q200; Resistance: 82; Series: RNCS; Size / Dimension: 0.061" L x 0.031" W (1.55mm x 0.80mm); Supplier Device Package: 0603
R23 = RNCS0603BKE10K0: RES 10K OHM 1% 0,1W 0603; Manufacturer: Stackpole Electronics Inc; Power (Watts): 0.063W, 1/16W; Temperature Coefficient: ±25ppm/°C; Tolerance: ±0.1%; Part Number: RNCS0603BKE10K0; Value: 10k; Composition: Thin Film; Device Package: 0603 (1608 Metric); Features: Anti-Corrosive, Automotive AEC-Q200, Moisture Resistant; Height - Seated (Max): 0.022" (0.55mm); LastUpdated: 09.02.2024 20:43:37; Lifecycle Status: Active; Minimum Order: 1; Number of Terminations: 2; Operating Temperature: -55°C ~ 155°C; Package / Case: 0603 (1608 Metric); Packaging: TapeAndReel; PartId: 4838; Part Status: Active; Price: 0.06; Ratings: AEC-Q200; Resistance: 10k; Series: RNCS; Size / Dimension: 0.061" L x 0.031" W (1.55mm x 0.80mm); Supplier Device Package: 0603
R25 = RNCS0603BKE10K0: RES 4,7K OHM 1% 0,1W 0603; Manufacturer: Stackpole Electronics Inc; Power (Watts): 0.063W, 1/16W; Temperature Coefficient: ±25ppm/°C; Tolerance: ±0.1%; Part Number: RNCS0603BKE10K0; Value: 4,7k; Composition: Thin Film; Device Package: 0603 (1608 Metric); Features: Anti-Corrosive, Automotive AEC-Q200, Moisture Resistant; Height - Seated (Max): 0.022" (0.55mm); LastUpdated: 09.02.2024 20:43:37; Lifecycle Status: Active; Minimum Order: 1; Number of Terminations: 2; Operating Temperature: -55°C ~ 155°C; Package / Case: 0603 (1608 Metric); Packaging: TapeAndReel; PartId: 4838; Part Status: Active; Price: 0.06; Ratings: AEC-Q200; Resistance: 4,7k; Series: RNCS; Size / Dimension: 0.061" L x 0.031" W (1.55mm x 0.80mm); Supplier Device Package: 0603
R26 = RNCS0603BKE10K0: RES 33K OHM 1% 0,1W 0603; Manufacturer: Stackpole Electronics Inc; Power (Watts): 0.063W, 1/16W; Temperature Coefficient: ±25ppm/°C; Tolerance: ±0.1%; Part Number: RNCS0603BKE10K0; Value: 33k; Composition: Thin Film; Device Package: 0603 (1608 Metric); Features: Anti-Corrosive, Automotive AEC-Q200, Moisture Resistant; Height - Seated (Max): 0.022" (0.55mm); LastUpdated: 09.02.2024 20:43:37; Lifecycle Status: Active; Minimum Order: 1; Number of Terminations: 2; Operating Temperature: -55°C ~ 155°C; Package / Case: 0603 (1608 Metric); Packaging: TapeAndReel; PartId: 4838; Part Status: Active; Price: 0.06; Ratings: AEC-Q200; Resistance: 33k; Series: RNCS; Size / Dimension: 0.061" L x 0.031" W (1.55mm x 0.80mm); Supplier Device Package: 0603
R27 = RNCS0603BKE10K0: RES 1,5K OHM 1% 0,1W 0603; Manufacturer: Stackpole Electronics Inc; Power (Watts): 0.063W, 1/16W; Temperature Coefficient: ±25ppm/°C; Tolerance: ±0.1%; Part Number: RNCS0603BKE10K0; Value: 1,5k; Composition: Thin Film; Device Package: 0603 (1608 Metric); Features: Anti-Corrosive, Automotive AEC-Q200, Moisture Resistant; Height - Seated (Max): 0.022" (0.55mm); LastUpdated: 09.02.2024 20:43:37; Lifecycle Status: Active; Minimum Order: 1; Number of Terminations: 2; Operating Temperature: -55°C ~ 155°C; Package / Case: 0603 (1608 Metric); Packaging: TapeAndReel; PartId: 4838; Part Status: Active; Price: 0.06; Ratings: AEC-Q200; Resistance: 1,5k; Series: RNCS; Size / Dimension: 0.061" L x 0.031" W (1.55mm x 0.80mm); Supplier Device Package: 0603
TP1 TP2 = Keystone 5006 Test Point: Keystone 5006 Test Point (BLACK)
U1 = LM25116MHX/NOPB: Wide Range Synchronous Buck Controller, 20-pin TSSOP-EP, Pb-Free; Manufacturer: Texas Instruments; CompType: Switcher; PowerWise: Y; PackageTopMarking: NSUZXYTT*LM25116*MH; PackageDescription: Molded TSSOP, Jedec, 6.5 x 4.4 x 0.9mm Body, 20 Lead, 0.65mm Pitch, Exposed Pad; PinCount: 20; Code_JEDEC: MO-153-ACT; ComponentLink1URL: http://www.ti.com/general/docs/lit/getliterature.tsp?genericPartNumber=LM25116&fileType=pdf; RoHS: Y; ComponentLink1Description: Datasheet URL; PackageReference: PWP0020A
U2-U4 = CMP-0244-00169-1: 3A, Low Drop Positive Voltage Regulator, 3.3V, 3-Pin D2PAK; ComponentLink1URL: http://www.st.com; PackageVersion: 2011; ComponentLink1Description: Manufacturer URL; ComponentLink2URL: http://www.st.com/internet/com/TECHNICAL_RESOURCES/TECHNICAL_LITERATURE/DATASHEET/CD00001883.pdf; PackageDescription: 3-Pin Transistor Outline Package 2.54 mm Pitch, 15.4 mm Lead Span (D2PAK); DatasheetVersion: 28/07/2009; ComponentLink2Description: Datasheet; PackageReference: TO-263

## Sheet Controllable_voltage_outputs.SchDoc
size A4; SheetNumber: 3; SheetTotal: 10
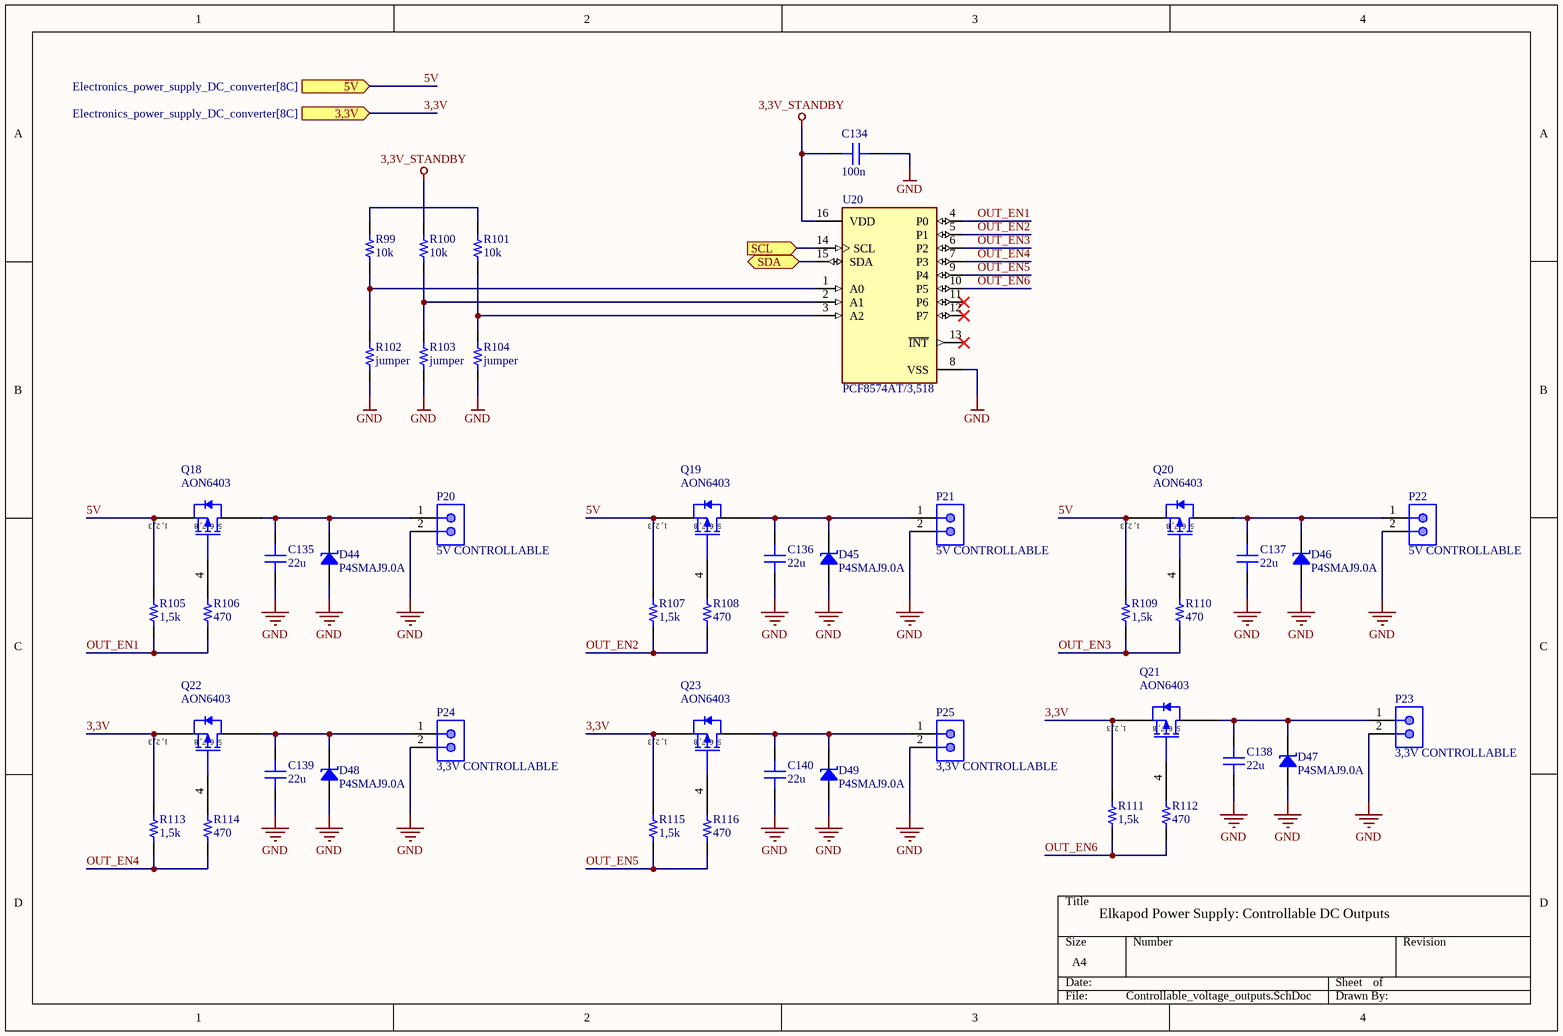
[diagram p8: Controllable_voltage_outputs.SchDoc]

### Parts
C134  100n  [CAP 0603_1608]
C135  22u  [CAP 0805_2012]
C136  22u  [CAP 0805_2012]
C137  22u  [CAP 0805_2012]
C138  22u  [CAP 0805_2012]
C139  22u  [CAP 0805_2012]
C140  22u  [CAP 0805_2012]
D44  P4SMAJ9.0A  [DO214AC SMA]
D45  P4SMAJ9.0A  [DO214AC SMA]
D46  P4SMAJ9.0A  [DO214AC SMA]
D47  P4SMAJ9.0A  [DO214AC SMA]
D48  P4SMAJ9.0A  [DO214AC SMA]
D49  P4SMAJ9.0A  [DO214AC SMA]
P20  5V CONTROLLABLE  [MOLX-22-23-2021_V]
P21  5V CONTROLLABLE  [MOLX-22-23-2021_V]
P22  5V CONTROLLABLE  [MOLX-22-23-2021_V]
P23  3,3V CONTROLLABLE  [MOLX-22-23-2021_V]
P24  3,3V CONTROLLABLE  [MOLX-22-23-2021_V]
P25  3,3V CONTROLLABLE  [MOLX-22-23-2021_V]
Q18  AON6403  [DFN5x6]
Q19  AON6403  [DFN5x6]
Q20  AON6403  [DFN5x6]
Q21  AON6403  [DFN5x6]
Q22  AON6403  [DFN5x6]
Q23  AON6403  [DFN5x6]
R99  10k  [RES 0603_1608]
R100  10k  [RES 0603_1608]
R101  10k  [RES 0603_1608]
R102  value jumper  [RES 0603_1608]  (hidden comment: A0_jumper)
R103  value jumper  [RES 0603_1608]  (hidden comment: A1_jumper)
R104  value jumper  [RES 0603_1608]  (hidden comment: A2_jumper)
R105  1,5k  [RES 0603_1608]
R106  470  [RES 0603_1608]
R107  1,5k  [RES 0603_1608]
R108  470  [RES 0603_1608]
R109  1,5k  [RES 0603_1608]
R110  470  [RES 0603_1608]
R111  1,5k  [RES 0603_1608]
R112  470  [RES 0603_1608]
R113  1,5k  [RES 0603_1608]
R114  470  [RES 0603_1608]
R115  1,5k  [RES 0603_1608]
R116  470  [RES 0603_1608]
U20  PCF8574AT/3,518  [FP-SOT162-1-MFG]

### Ports
3,3V (in, see Electronics_power_supply_DC_converter[8C]), 5V (in, see Electronics_power_supply_DC_converter[8C]), SCL (in, see Electronics_power_supply_DC_converter[8C], Electronics_power_supply_DC_converter[7C], Logic_controller[1D], Servos_controller[1C], Servos_DC_converter[5A]), SDA (bidir, see Electronics_power_supply_DC_converter[8C], Electronics_power_supply_DC_converter[7C], Logic_controller[1D], Servos_controller[1C], Servos_DC_converter[5A])

### Nets
3,3V_STANDBY: C134.2 R100.1 U20.16(VDD)
GND: C134.1 C135.1 C136.1 C137.1 C138.1 C139.1 C140.1 D44.1 D45.1 D46.1 D47.1 D48.1 D49.1 P20.2 P21.2 P22.2 P23.2 P24.2 P25.2 R102.2 R103.2 R104.2 U20.8(VSS)  [project net AGND]
3,3V: Q21.1(S) Q21.2(S) Q21.3(S) Q22.1(S) Q22.2(S) Q22.3(S) Q23.1(S) Q23.2(S) Q23.3(S) R111.1 R113.1 R115.1 ; port 3,3V  [project net 3,3V_Vout2]
5V: Q18.1(S) Q18.2(S) Q18.3(S) Q19.1(S) Q19.2(S) Q19.3(S) Q20.1(S) Q20.2(S) Q20.3(S) R105.1 R107.1 R109.1 ; port 5V  [project net 5V_converter_Vout]
OUT_EN1: R105.2 R106.2 U20.4(P0)  [project net OUT_EN1_3]
OUT_EN2: R107.2 R108.2 U20.5(P1)  [project net OUT_EN2_3]
OUT_EN3: R109.2 R110.2 U20.6(P2)  [project net OUT_EN3_3]
OUT_EN4: R113.2 R114.2 U20.7(P3)  [project net OUT_EN4_3]
OUT_EN5: R115.2 R116.2 U20.9(P4)  [project net OUT_EN5_3]
OUT_EN6: R111.2 R112.2 U20.10(P5)  [project net OUT_EN6_3]
SCL: U20.14(SCL) ; port SCL
SDA: U20.15(SDA) ; port SDA
NetC135_2: C135.2 D44.2 P20.1 Q18.5-6-7-8(D)
NetC136_2: C136.2 D45.2 P21.1 Q19.5-6-7-8(D)
NetC137_2: C137.2 D46.2 P22.1 Q20.5-6-7-8(D)
NetC138_2: C138.2 D47.2 P23.1 Q21.5-6-7-8(D)
NetC139_2: C139.2 D48.2 P24.1 Q22.5-6-7-8(D)
NetC140_2: C140.2 D49.2 P25.1 Q23.5-6-7-8(D)
NetQ18_4: Q18.4(G) R106.1
NetQ19_4: Q19.4(G) R108.1
NetQ20_4: Q20.4(G) R110.1
NetQ21_4: Q21.4(G) R112.1
NetQ22_4: Q22.4(G) R114.1
NetQ23_4: Q23.4(G) R116.1
NetR99_1: R99.1 R101.1
NetR99_2: R99.2 R102.1 U20.1(A0)
NetR100_2: R100.2 R103.1 U20.2(A1)
NetR101_2: R101.2 R104.1 U20.3(A2)

Not connected (* = marked no-connect by the designer): U20 11(P6)* 12(P7)* 13(~{INT})*

### Notes on the sheet
- Elkapod Power Supply: Controllable DC Outputs
- (in symbol AON6403) 1, 2, 3; 5, 6, 7, 8

### Library data of the parts
C134 = C0603C272F3GAC7867: CAP CER 100nF 25V X5R 0603; manufacturer: KEMET; Temperature Coefficient: C0G, NP0; Tolerance: ±1%; Part Number: C0603C272F3GAC7867; Value: 100n; Applications: General Purpose; Capacitance: 100n; componentlink1description: Datasheet; componentlink1url: https://api.kemet.com/component-edge/download/datasheet/C0603C272F3GACTU.pdf; componentlink2description: DigiKey Link; componentlink2url: https://www.digikey.com/en/products/detail/kemet/C0603C272F3GAC7867/2200413; Device Package: 0603 (1608 Metric); Features: Low ESL; lastupdated: 09.02.2024 20:10:30; Lifecycle Status: Active; Minimum Order: 1; Mounting Type: Surface Mount, MLCC; Operating Temperature: -55°C ~ 125°C; Package / Case: 0603 (1608 Metric); packaging: TapeAndReel; partid: 2138; Part Status: Active; price: 0.40; series: SMD Comm C0G; Size / Dimension: 0.063" L x 0.031" W (1.60mm x 0.80mm); Thickness (Max): 0.034" (0.87mm); Voltage - Rated: 25V
C135-C140 = VJ0805Y684KXQTW1BC: as C3 on sheet Electronics_power_supply_DC_converter; Part Number: VJ0805Y684KXQTW1BC; Value: 22u; Applications: General Purpose; Capacitance: 22u; componentlink1description: Datasheet; componentlink1url: https://www.vishay.com/docs/28548/vjw1bcbascomseries.pdf; componentlink2description: DigiKey Link; componentlink2url: https://www.digikey.com/en/products/detail/vishay-vitramon/VJ0805Y684KXQTW1BC/8313569; Device Package: 0805 (2012 Metric); lastupdated: 09.02.2024 20:13:13; Lifecycle Status: Active; Minimum Order: 1; Mounting Type: Surface Mount, MLCC; Operating Temperature: -55°C ~ 125°C; Package / Case: 0805 (2012 Metric); packaging: TapeAndReel; partid: 57262; price: 0.05; series: VJ W1BC; Size / Dimension: 0.079" L x 0.049" W (2.00mm x 1.25mm); Temperature Coefficient: X7R; Thickness (Max): 0.053" (1.35mm)
D44-D49 = SMA6J18A-TP: TVS DIODE 9VDC DO214AC; Part Number: P4SMAJ9.0A
P20-P25 = CMP-1704-00001-3: as P4 on sheet Electronics_power_supply_DC_converter; Package Quantity: 3000; Height: 10.67 mm; RoHSCompliant: True; ComponentLink2URL: https://datasheet.ciiva.com/19454/232266-19454304.pdf; PartNumber: 22-23-2021; Packaging: Bulk; ComponentLink2Description: Datasheet; Min Operating Temperature: 0 degC; ComponentLink1Description: Manufacturer URL; Length: 5.08 mm; Mounting Technology: Through Hole; Max Operating Temperature: 75 degC; REACH SVHC: Unknown; PackageDescription: Male Header, Pitch 2.54 mm, 1 x 2 Position, Height 10.67 mm, Tail Length 3.56 mm; ComponentLink1URL: http://www.molex.com/; Mount: Through Hole; Radiation Hardening: No; Width: 6.35 mm; Pins: 2
Q18-Q23 = AON6403: P-MOSFET; 67A; 30V; DFN5x6
R99-R101 = RNCS0603BKE10K0: as R23 on sheet Electronics_power_supply_DC_converter; Part Number: RNCS0603BKE10K0; Value: 10k; Composition: Thin Film; Device Package: 0603 (1608 Metric); Features: Anti-Corrosive, Automotive AEC-Q200, Moisture Resistant; Height - Seated (Max): 0.022" (0.55mm); LastUpdated: 09.02.2024 20:43:37; Lifecycle Status: Active; Minimum Order: 1; Number of Terminations: 2; Operating Temperature: -55°C ~ 155°C; Package / Case: 0603 (1608 Metric); Packaging: TapeAndReel; PartId: 4838; Part Status: Active; Price: 0.06; Ratings: AEC-Q200; Resistance: 10k; Series: RNCS; Size / Dimension: 0.061" L x 0.031" W (1.55mm x 0.80mm); Supplier Device Package: 0603
R102-R104 = RNCS0603BKE10K0: RES 0 OHM 1% 0,1W 0603; Manufacturer: Stackpole Electronics Inc; Power (Watts): 0.063W, 1/16W; Resistance: 0; Temperature Coefficient: ±25ppm/°C; Tolerance: ±0.1%; Part Number: RNCS0603BKE10K0; Composition: Thin Film; Device Package: 0603 (1608 Metric); Features: Anti-Corrosive, Automotive AEC-Q200, Moisture Resistant; Height - Seated (Max): 0.022" (0.55mm); LastUpdated: 09.02.2024 20:43:37; Lifecycle Status: Active; Minimum Order: 1; Number of Terminations: 2; Operating Temperature: -55°C ~ 155°C; Package / Case: 0603 (1608 Metric); Packaging: TapeAndReel; PartId: 4838; Part Status: Active; Price: 0.06; Ratings: AEC-Q200; Series: RNCS; Size / Dimension: 0.061" L x 0.031" W (1.55mm x 0.80mm); Supplier Device Package: 0603
R105 R107 R109 R111 R113 R115 = RNCS0603BKE10K0: as R27 on sheet Electronics_power_supply_DC_converter; Part Number: RNCS0603BKE10K0; Value: 1,5k; Composition: Thin Film; Device Package: 0603 (1608 Metric); Features: Anti-Corrosive, Automotive AEC-Q200, Moisture Resistant; Height - Seated (Max): 0.022" (0.55mm); LastUpdated: 09.02.2024 20:43:37; Lifecycle Status: Active; Minimum Order: 1; Number of Terminations: 2; Operating Temperature: -55°C ~ 155°C; Package / Case: 0603 (1608 Metric); Packaging: TapeAndReel; PartId: 4838; Part Status: Active; Price: 0.06; Ratings: AEC-Q200; Resistance: 1,5k; Series: RNCS; Size / Dimension: 0.061" L x 0.031" W (1.55mm x 0.80mm); Supplier Device Package: 0603
R106 R108 R110 R112 R114 R116 = RNCS0603BKE10K0: as R15 on sheet Electronics_power_supply_DC_converter; Part Number: RNCS0603BKE10K0; Value: 470; Composition: Thin Film; Device Package: 0603 (1608 Metric); Features: Anti-Corrosive, Automotive AEC-Q200, Moisture Resistant; Height - Seated (Max): 0.022" (0.55mm); LastUpdated: 09.02.2024 20:43:37; Lifecycle Status: Active; Minimum Order: 1; Number of Terminations: 2; Operating Temperature: -55°C ~ 155°C; Package / Case: 0603 (1608 Metric); Packaging: TapeAndReel; PartId: 4838; Part Status: Active; Price: 0.06; Ratings: AEC-Q200; Resistance: 470; Series: RNCS; Size / Dimension: 0.061" L x 0.031" W (1.55mm x 0.80mm); Supplier Device Package: 0603
U20 = CMP-10112-000003-1: IC I/O EXPANDER I2C 8B 16SOIC; Manufacturer: NXP Semiconductors; Interface: I2C,SMBus; Frequency: 100kHz; Nominal Supply Current: 40uA; Max Supply Voltage: 6V; Number Of I/Os: 8; Max Junction Temp: +125°C; Min Supply Voltage: 2.5V; Standoff Height: 0.1mm; RoHS: TRUE; Category: IC; Temperature: -40°C to +85°C; Device Class L3: I/O Expanders; ComponentLink2Description: Datasheet; ComponentLink2URL: https://www.nxp.com/docs/en/data-sheet/PCF8574_PCF8574A.pdf; Digikey Description: IC I/O EXPANDER I2C 8B 16SOIC; Ipc Land Pattern Name: SOIC127P1032X265-16; Mouser Description: PCF8574 Series 2.5 to 6V Remote 8-bit I/O Expander for I2C-bus -SOIC-16; Footprint Url: https://www.nxp.com/docs/en/package-information/SOT162-1.pdf; Lead Free: Yes; Device Class L2: Interface ICs; Ambient Temperature Range Low: -40°C; Temperature Range High: +85°C; Automotive: No; Manufacturer Part Number: PCF8574AT/3,518; Ambient Temperature Range High: +85°C; Height: 2.65mm; Package: SOT162-1; Temperature Range Low: -40°C; Octopart: https://octopart.com/pcf8574at%2F3%2C518-nxp+semiconductors-11541925; Device Class L1: Integrated Circuits (ICs)